# Altium schematic sheet POWER_RAIL_CTRL.SchDoc
size B
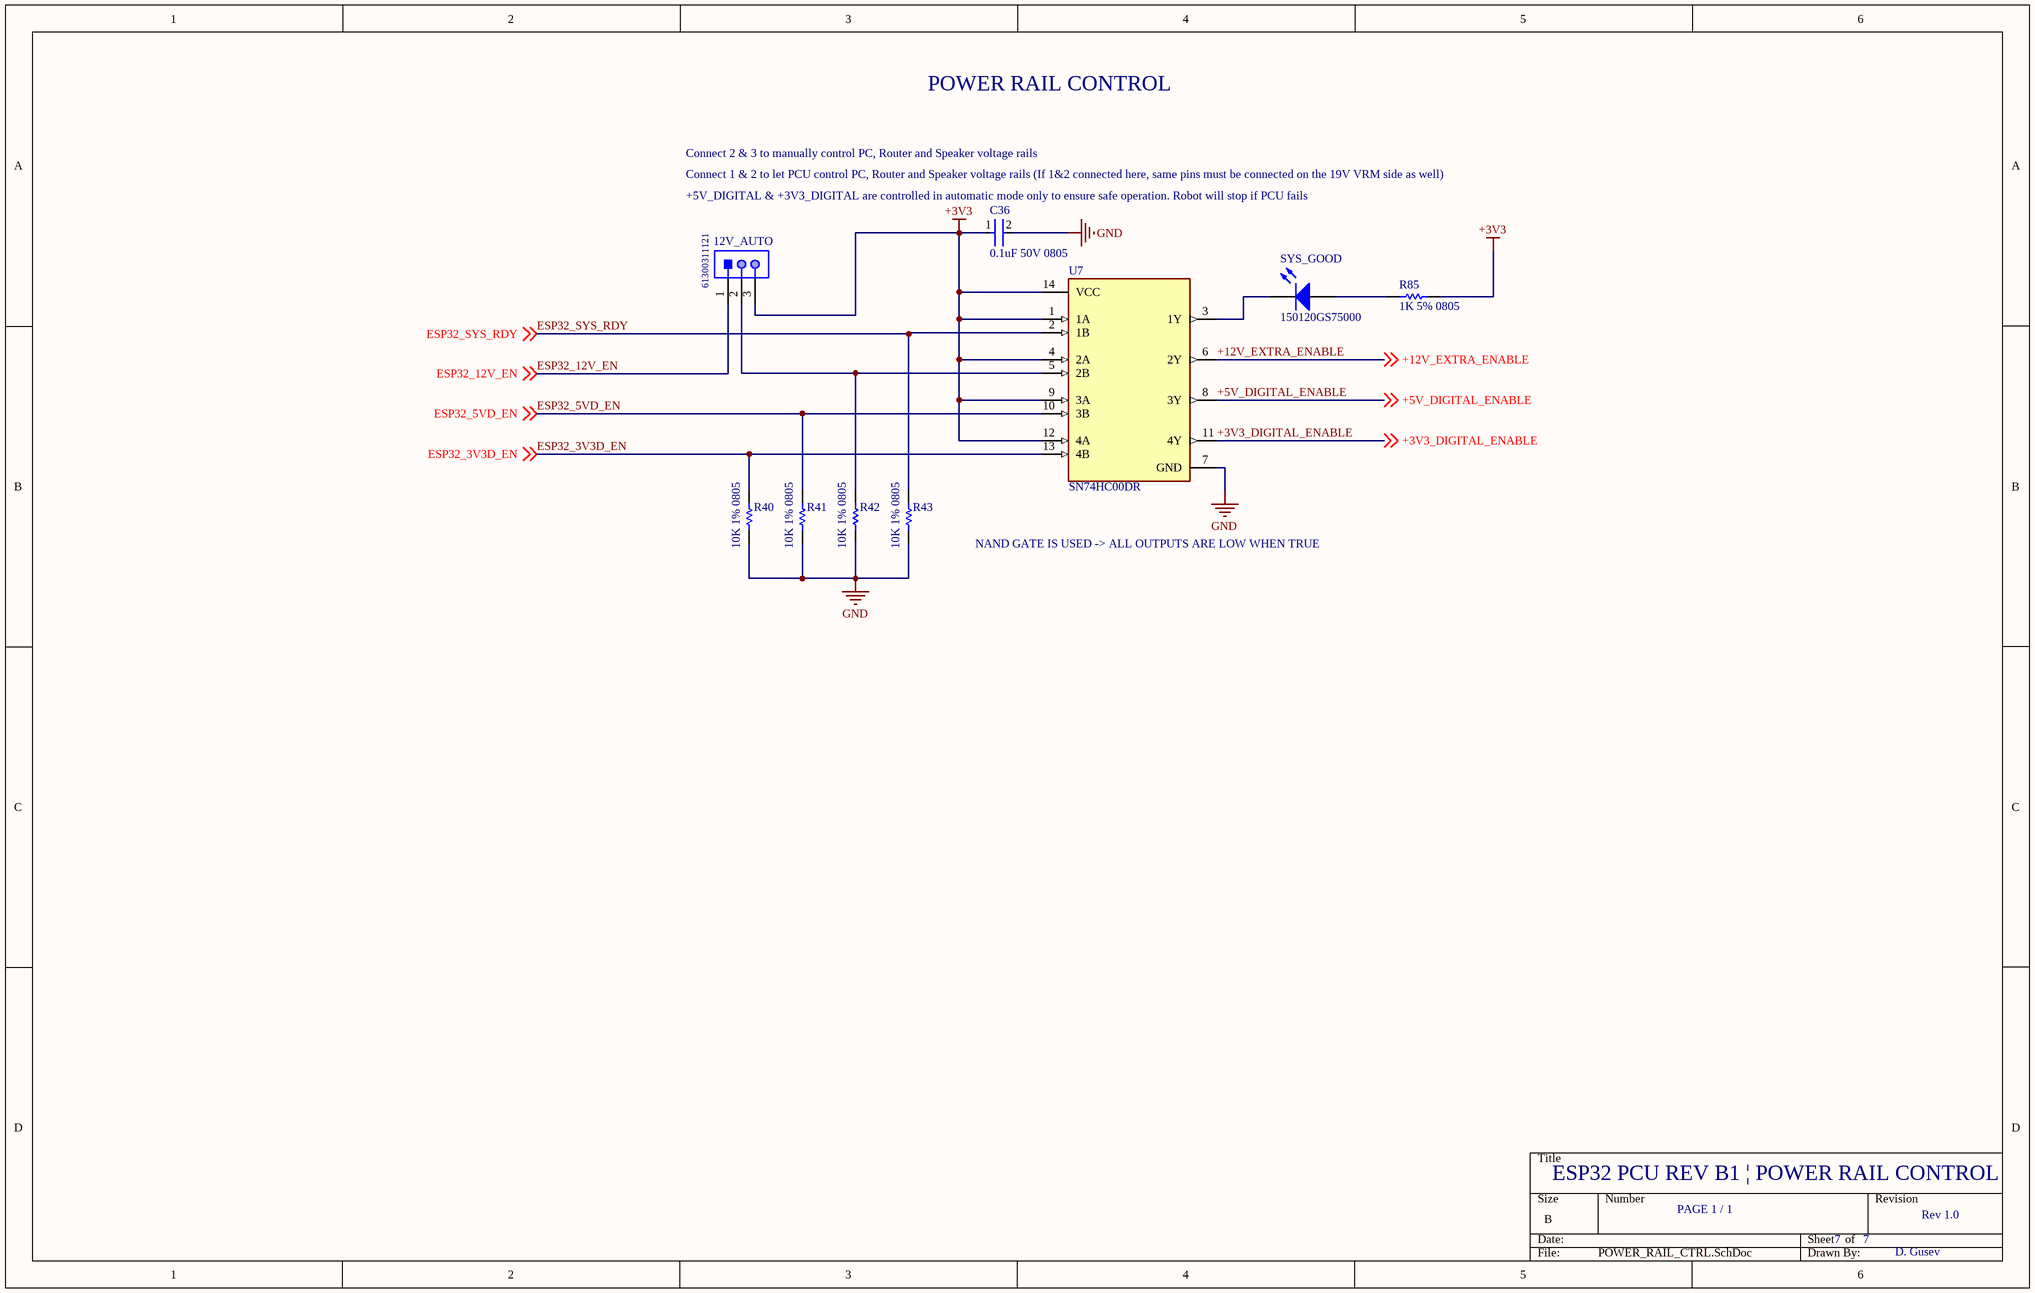
[diagram p0: POWER_RAIL_CTRL.SchDoc]

## Parts
12V_AUTO  61300311121  [61300311121]
C36  0.1uF 50V 0805  [FP-C0805C-DN-MFG]
R40  10K 1% 0805  [RESC2013X60X35NL10T20]
R41  10K 1% 0805  [RESC2013X60X35NL10T20]
R42  10K 1% 0805  [RESC2013X60X35NL10T20]
R43  10K 1% 0805  [RESC2013X60X35NL10T20]
R85  1K 5% 0805  [RESC2013X60X40ML20T25]
SYS_GOOD  150120GS75000  [1206_A]
U7  SN74HC00DR  [FP-D0014A-MFG]

## Nets
+3V3: 12V_AUTO.3 C36.1 R85.1 U7.1(1A) U7.4(2A) U7.9(3A) U7.12(4A) U7.14(VCC)
GND: C36.2 R40.1 R41.1 R42.1 R43.1 U7.7(GND)
+3V3_DIGITAL_ENABLE: U7.11(4Y) ; off-sheet +3V3_DIGITAL_ENABLE
+5V_DIGITAL_ENABLE: U7.8(3Y) ; off-sheet +5V_DIGITAL_ENABLE
+12V_EXTRA_ENABLE: U7.6(2Y) ; off-sheet +12V_EXTRA_ENABLE
ESP32_3V3D_EN: R40.2 U7.13(4B) ; off-sheet ESP32_3V3D_EN
ESP32_5VD_EN: R41.2 U7.10(3B) ; off-sheet ESP32_5VD_EN
ESP32_12V_EN: 12V_AUTO.1 ; off-sheet ESP32_12V_EN
ESP32_SYS_RDY: R43.2 U7.2(1B) ; off-sheet ESP32_SYS_RDY
Net12V_AUTO_2: 12V_AUTO.2 R42.2 U7.5(2B)
NetR85_2: R85.2 SYS_GOOD.2(A)
NetSYS_GOOD_1: SYS_GOOD.1(K) U7.3(1Y)

## Notes on the sheet
- POWER RAIL CONTROL
- Connect 2 & 3 to manually control PC, Router and Speaker voltage rails
- (near C36) Connect 1 & 2 to let PCU control PC, Router and Speaker voltage rails (If 1&2 connected here, same pins must be connected on the 19V VRM side as well)
- (near C36) +5V_DIGITAL & +3V3_DIGITAL are controlled in automatic mode only to ensure safe operation. Robot will stop if PCU fails
- NAND GATE IS USED -> ALL OUTPUTS ARE LOW WHEN TRUE
- ESP32 PCU REV B1 | POWER RAIL CONTROL
- PAGE 1 / 1
- 7
- Rev 1.0
- D. Gusev

## Library data of the parts
12V_AUTO = CMP-1502-01062-1: THT Vertical Pin Header WR-PHD, Pitch 2.54 mm, Single Row, 3 pins; Manufacturer: Wurth Elektronik; Withstanding Voltage: 500VAC; Working Voltage: 250VAC; Rated Current: 3A; Pitch: 2.54mm; Pin Number: 3; Gender: Male; Contact Resistance: 20mOhm; Package Reference: 61300311121; Manufacturer URL: http://www.we-online.de; Datasheet URL: https://katalog.we-online.de/em/datasheet/6130xx11121.pdf; Operating Temperature: -40to105degC; Part Number: 61300311121; Orientation: Vertical; Packaging: Bag; Row Number: Single; Mounting Technology: THT; Publisher: WurthElektronik
C36 = CMP-2007-00279-2: CAP CER 0.1UF 50V X7R 0805; Manufacturer Part Number: C0805C104K5RACTU; Manufacturer: KEMET; Value: 0.10 μF; Tolerance: 0.1; Temperature Coefficient: 30ppm/°C; Material: Ceramic; Device Class L2: Capacitors; Temperature Range Low: -55°C; Voltage Rating: 50 V; Digikey Description: CAP CER 0.1UF 50V X7R 0805; Category: Cap; ComponentLink2Description: Datasheet; Octopart: https://octopart.com/c0805c104k5ractu-kemet-143926; RoHS: TRUE; ComponentLink2URL: https://content.kemet.com/datasheets/KEM_C1003_C0G_SMD.pdf; Temperature Characteristic: X7R; Temperature: -55°C to +125°C; Height: 0.88mm; Temperature Range High: +125°C; Device Class L1: Passive Components; Automotive: No; Lead Free: Yes; Ipc Land Pattern Name: CAPC200125X78; Device Class L3: Ceramic Capacitors; Mouser Description: Cap Ceramic 0.1uF 50V X7R 10% SMD 2.0 x 1.2 mm 125 C Paper T/R; Capacitance: 0.10 μF; Package: C0805C-DN
R40-R43 = CMP-1659-00013-4: Chip Resistor, 10 KOhm, +/- 1%, 0.125 W, -55 to 155 degC, 0805 (2012 Metric), RoHS, Tape and Reel; Manufacturer: Yageo; Voltage Rating: 150 V; Mount: Surface Mount; ComponentLink1Description: Manufacturer URL; ComponentLink2URL: http://www.yageo.com/documents/recent/PYu-RC_Group_51_RoHS_L_04.pdf; Pins: 2; Length: 2 mm; Min Operating Temperature: -55 degC; Height: 0.5 mm; Mounting Technology: Surface Mount; RoHSCompliant: true; REACH SVHC: No SVHC; ComponentLink1URL: http://www.yageo.com/; Max Operating Temperature: 155 degC; PackageReference: 0805; DatasheetVersion: Rev. 4, 02/2016; Package Quantity: 5000; Packaging: Tape and Reel; ComponentLink2Description: Datasheet; PackageDescription: 2-Pin Surface Mounted Device, Body 2 x 1.25 mm
R85 = CMP-2001-00590-1: Part Number: ERA6AEB123V; Manufacturer: Panasonic
SYS_GOOD = CMP-1426-00014-1: SMD mono-color Chip LED, WL-SMCW, Green; Manufacturer: Wuerth Elektronik; PackageReference: 1206_A; PartNumber: 150120GS75000; ComponentLink1Description: Manufacturer URL; ComponentLink2URL: http://katalog.we-online.com/led/datasheet/150120GS75000.pdf; ComponentLink2Description: Datasheet; Color: Green; ComponentLink1URL: http://www.we-online.com
U7 = CMP-1622-00008-3: IC GATE NAND 4CH 2-INP 14SOIC; Number of Bits: 4; Number of Input Lines: 2; Max Supply Voltage: 6V; Operating Supply Voltage: 5V; Min Supply Voltage: 2V; Logic Function: NAND GATE; Low Level Output Current: 5.2mA; Turn-On Delay Time: 23ns; Number of Outputs: 1; Output Current: 25mA; Quiescent Current: 2uA; Schmitt Trigger Input: No; High Level Output Current: -5.2mA; Propagation Delay: 15ns; Radiation Hardening: No; Contact Plating: Tin; Packaging: Tape and Reel; Number of Pins: 14; Max Operating Temperature: 85°C; Mount: Surface Mount; REACH SVHC: No SVHC; Case/Package: SOIC; Package Quantity: 1; Length: 8.65mm; Number of Circuits: 4; Number of Gates: 4; Height: 1.58mm; Min Operating Temperature: -40°C; Weight: 0.004318oz; Number of Output Lines: 1; RoHS Compliant: Yes; Width: 3.91mm; Lead Free: Lead Free; Number of Inputs: 2; Number of Elements: 4